# EAGLE design l298_updated (EAGLE 8.0.0)
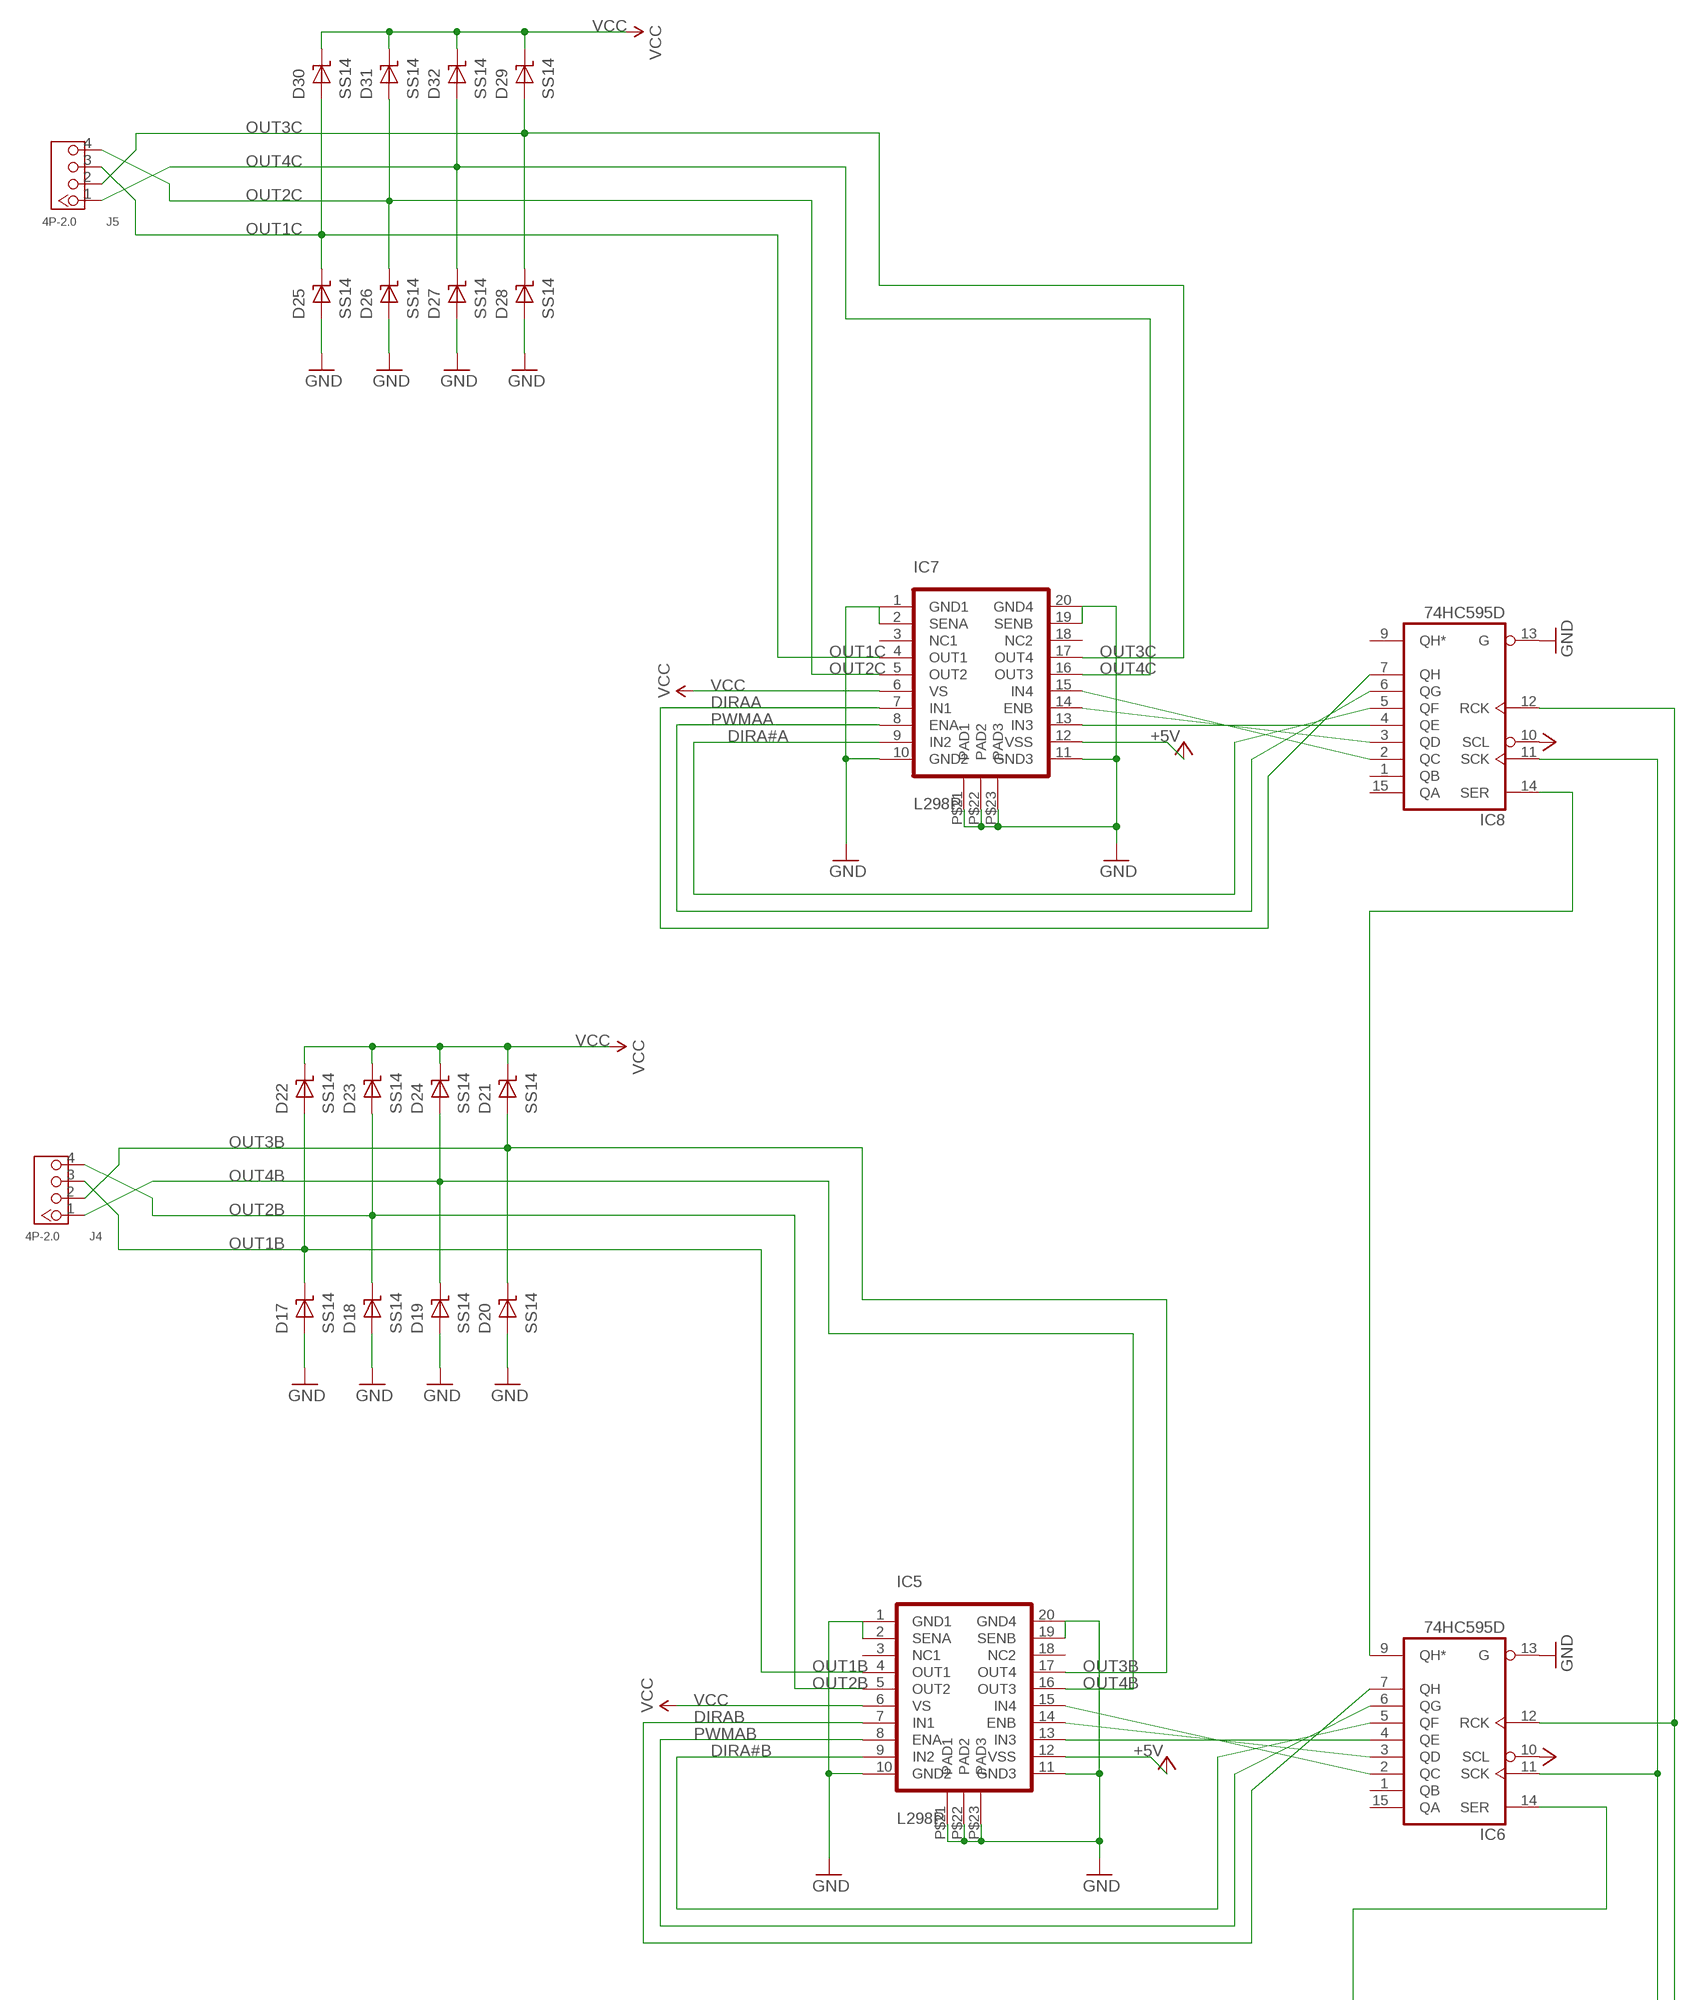
[diagram p0: schematic, sheet 1, part 1 of 2]
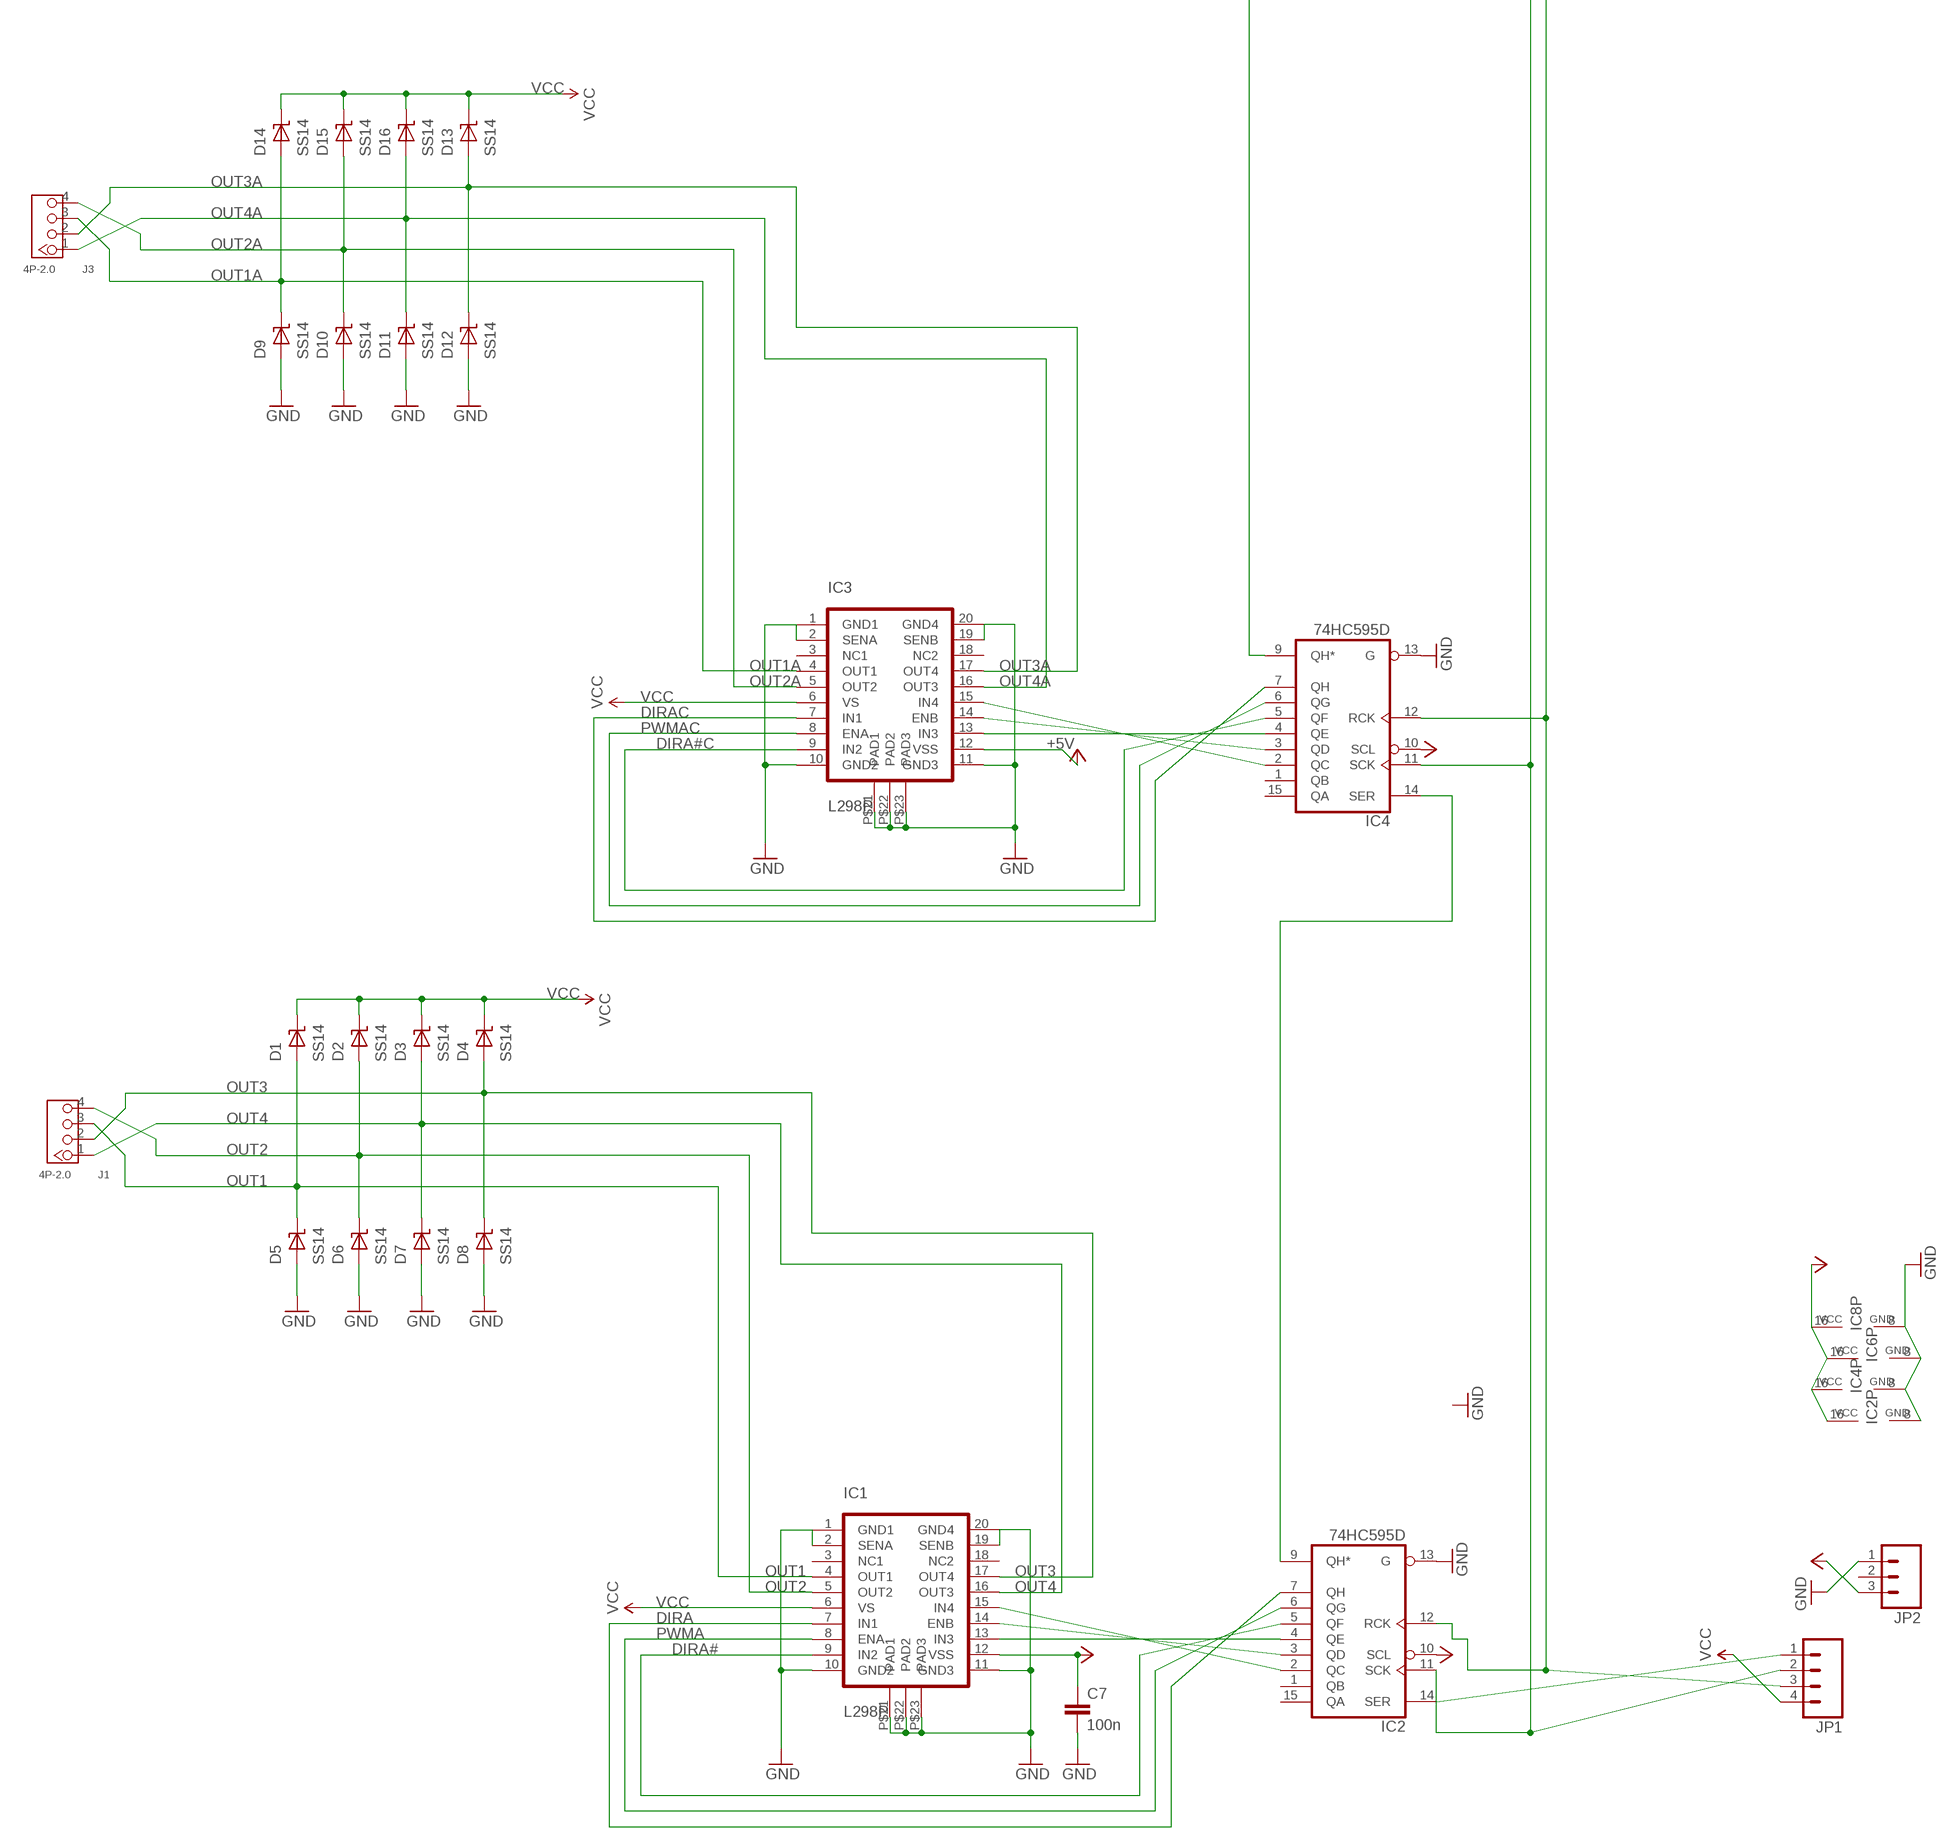
[diagram p1: schematic, sheet 1, part 2 of 2]

## Parts
C7  100n  C-EUC0603  [C0603-ROUND]
D1  SS14  [SMA]
D2  SS14  [SMA]
D3  SS14  [SMA]
D4  SS14  [SMA]
D5  SS14  [SMA]
D6  SS14  [SMA]
D7  SS14  [SMA]
D8  SS14  [SMA]
D9  SS14  [SMA]
D10  SS14  [SMA]
D11  SS14  [SMA]
D12  SS14  [SMA]
D13  SS14  [SMA]
D14  SS14  [SMA]
D15  SS14  [SMA]
D16  SS14  [SMA]
D17  SS14  [SMA]
D18  SS14  [SMA]
D19  SS14  [SMA]
D20  SS14  [SMA]
D21  SS14  [SMA]
D22  SS14  [SMA]
D23  SS14  [SMA]
D24  SS14  [SMA]
D25  SS14  [SMA]
D26  SS14  [SMA]
D27  SS14  [SMA]
D28  SS14  [SMA]
D29  SS14  [SMA]
D30  SS14  [SMA]
D31  SS14  [SMA]
D32  SS14  [SMA]
IC1  L298P  [POWER-SO20]
IC2  74HC595D  [SO16]
IC3  L298P  [POWER-SO20]
IC4  74HC595D  [SO16]
IC5  L298P  [POWER-SO20]
IC6  74HC595D  [SO16]
IC7  L298P  [POWER-SO20]
IC8  74HC595D  [SO16]
J1  4P-2.0  GROVE-CONNECTOR-DIP(4P-2.0)  [HW4-2.0]
J3  4P-2.0  GROVE-CONNECTOR-DIP(4P-2.0)  [HW4-2.0]
J4  4P-2.0  GROVE-CONNECTOR-DIP(4P-2.0)  [HW4-2.0]
J5  4P-2.0  GROVE-CONNECTOR-DIP(4P-2.0)  [HW4-2.0]
JP1  M04PTH  [1X04]
JP2  M03PTH  [1X03]

## Nets
+5V [power]: C7.1 IC1.P$12(VSS) IC2.10(SCL) IC2.16(VCC) IC3.P$12(VSS) IC4.10(SCL) IC4.16(VCC) IC5.P$12(VSS) IC6.10(SCL) IC6.16(VCC) IC7.P$12(VSS) IC8.10(SCL) IC8.16(VCC) JP2.3
DIRA [Data]: IC1.P$7(IN1) IC2.7(QH)
DIRA# [Data]: IC1.P$9(IN2) IC2.5(QF)
DIRA#A [Data]: IC7.P$9(IN2) IC8.5(QF)
DIRA#B [Data]: IC5.P$9(IN2) IC6.5(QF)
DIRA#C [Data]: IC3.P$9(IN2) IC4.5(QF)
DIRAA [Data]: IC7.P$7(IN1) IC8.7(QH)
DIRAB [Data]: IC5.P$7(IN1) IC6.7(QH)
DIRAC [Data]: IC3.P$7(IN1) IC4.7(QH)
GND [Data]: C7.2 D5.P$2(A) D6.P$2(A) D7.P$2(A) D8.P$2(A) D9.P$2(A) D10.P$2(A) D11.P$2(A) D12.P$2(A) D17.P$2(A) D18.P$2(A) D19.P$2(A) D20.P$2(A) D25.P$2(A) D26.P$2(A) D27.P$2(A) D28.P$2(A) IC1.P$1(GND1) IC1.P$2(SENA) IC1.P$10(GND2) IC1.P$11(GND3) IC1.P$19(SENB) IC1.P$20(GND4) IC1.P$21(PAD1) IC1.P$22(PAD2) IC1.P$23(PAD3) IC2.8(GND) IC2.13(G) IC3.P$1(GND1) IC3.P$2(SENA) IC3.P$10(GND2) IC3.P$11(GND3) IC3.P$19(SENB) IC3.P$20(GND4) IC3.P$21(PAD1) IC3.P$22(PAD2) IC3.P$23(PAD3) IC4.8(GND) IC4.13(G) IC5.P$1(GND1) IC5.P$2(SENA) IC5.P$10(GND2) IC5.P$11(GND3) IC5.P$19(SENB) IC5.P$20(GND4) IC5.P$21(PAD1) IC5.P$22(PAD2) IC5.P$23(PAD3) IC6.8(GND) IC6.13(G) IC7.P$1(GND1) IC7.P$2(SENA) IC7.P$10(GND2) IC7.P$11(GND3) IC7.P$19(SENB) IC7.P$20(GND4) IC7.P$21(PAD1) IC7.P$22(PAD2) IC7.P$23(PAD3) IC8.8(GND) IC8.13(G) JP2.1
N$1 [Data]: IC2.9(QH*) IC4.14(SER)
N$2: IC4.9(QH*) IC6.14(SER)
N$3: IC6.9(QH*) IC8.14(SER)
N$4 [Data]: IC1.P$13(IN3) IC2.4(QE)
N$5 [Data]: IC1.P$14(ENB) IC2.3(QD)
N$6 [Data]: IC2.14(SER) JP1.1
N$7 [Data]: IC2.11(SCK) IC4.11(SCK) IC6.11(SCK) IC8.11(SCK) JP1.2
N$8 [Data]: IC2.12(RCK) IC4.12(RCK) IC6.12(RCK) IC8.12(RCK) JP1.3
N$9 [Data]: IC1.P$15(IN4) IC2.2(QC)
N$10 [Data]: IC3.P$13(IN3) IC4.4(QE)
N$11 [Data]: IC3.P$14(ENB) IC4.3(QD)
N$12 [Data]: IC3.P$15(IN4) IC4.2(QC)
N$13 [Data]: IC5.P$13(IN3) IC6.4(QE)
N$14 [Data]: IC5.P$14(ENB) IC6.3(QD)
N$15 [Data]: IC5.P$15(IN4) IC6.2(QC)
N$16 [Data]: IC7.P$13(IN3) IC8.4(QE)
N$17 [Data]: IC7.P$14(ENB) IC8.3(QD)
N$18 [Data]: IC7.P$15(IN4) IC8.2(QC)
OUT1 [power]: D1.P$2(A) D5.P$1(K) IC1.P$4(OUT1) J1.3
OUT1A [power]: D9.P$1(K) D14.P$2(A) IC3.P$4(OUT1) J3.3
OUT1B [power]: D17.P$1(K) D22.P$2(A) IC5.P$4(OUT1) J4.3
OUT1C [power]: D25.P$1(K) D30.P$2(A) IC7.P$4(OUT1) J5.3
OUT2 [power]: D2.P$2(A) D6.P$1(K) IC1.P$5(OUT2) J1.4
OUT2A [power]: D10.P$1(K) D15.P$2(A) IC3.P$5(OUT2) J3.4
OUT2B [power]: D18.P$1(K) D23.P$2(A) IC5.P$5(OUT2) J4.4
OUT2C [power]: D26.P$1(K) D31.P$2(A) IC7.P$5(OUT2) J5.4
OUT3 [power]: D4.P$2(A) D8.P$1(K) IC1.P$17(OUT4) J1.2
OUT3A [power]: D12.P$1(K) D13.P$2(A) IC3.P$17(OUT4) J3.2
OUT3B [power]: D20.P$1(K) D21.P$2(A) IC5.P$17(OUT4) J4.2
OUT3C [power]: D28.P$1(K) D29.P$2(A) IC7.P$17(OUT4) J5.2
OUT4 [power]: D3.P$2(A) D7.P$1(K) IC1.P$16(OUT3) J1.1
OUT4A [power]: D11.P$1(K) D16.P$2(A) IC3.P$16(OUT3) J3.1
OUT4B [power]: D19.P$1(K) D24.P$2(A) IC5.P$16(OUT3) J4.1
OUT4C [power]: D27.P$1(K) D32.P$2(A) IC7.P$16(OUT3) J5.1
PWMA [Data]: IC1.P$8(ENA) IC2.6(QG)
PWMAA [Data]: IC7.P$8(ENA) IC8.6(QG)
PWMAB [Data]: IC5.P$8(ENA) IC6.6(QG)
PWMAC [Data]: IC3.P$8(ENA) IC4.6(QG)
VCC [Data]: D1.P$1(K) D2.P$1(K) D3.P$1(K) D4.P$1(K) D13.P$1(K) D14.P$1(K) D15.P$1(K) D16.P$1(K) D21.P$1(K) D22.P$1(K) D23.P$1(K) D24.P$1(K) D29.P$1(K) D30.P$1(K) D31.P$1(K) D32.P$1(K) IC1.P$6(VS) IC3.P$6(VS) IC5.P$6(VS) IC7.P$6(VS) JP1.4
Unconnected: IC1.P$3(NC1) IC1.P$18(NC2) IC2.1(QB) IC2.15(QA) IC3.P$3(NC1) IC3.P$18(NC2) IC4.1(QB) IC4.15(QA) IC5.P$3(NC1) IC5.P$18(NC2) IC6.1(QB) IC6.15(QA) IC7.P$3(NC1) IC7.P$18(NC2) IC8.1(QB) IC8.9(QH*) IC8.15(QA) JP2.2

## Library data of the parts
C7 = SmartPrj:C-EU: CAPACITOR, European symbol
D1-D32 = SmartPrj:SS14: DIODE SS14 Diode Schottky 1A 40v
IC1 IC3 IC5 IC7 = SmartPrj:L298P: L298P DUAL FUL-BRIDGE DRIVER PowerSO20
IC2 IC4 IC6 IC8 = 74xx:74*595: 8-bit SHIFT REGISTER, output latch
J1 J3-J5 = Seeed-OPL-Connector:GROVE-CONNECTOR-DIP(4P-2.0): 320110033
JP1 = SparkFun:M04: Header 4 Standard 4-pin 0.1" header. Use with straight break away headers (SKU : PRT-00116), right angle break away headers (PRT-00553), swiss pins (PRT-00743), machine pins (PRT-00117), and female headers (PRT-00115). Molex polarized connector foot print use with SKU : PRT-08231 with associated crimp pins and housings.
JP2 = SparkFun:M03: Header 3 Standard 3-pin 0.1" header. Use with straight break away headers (SKU : PRT-00116), right angle break away headers (PRT-00553), swiss pins (PRT-00743), machine pins (PRT-00117), and female headers (PRT-00115). Molex polarized connector foot print use with SKU : PRT-08232 with associated crimp pins and housings.

## Net classes
0 default: width 0.305 mm, drill 0.991 mm, clearance 0.102 mm
1 power: width 0.305 mm, drill 0.991 mm, clearance 0.102 mm
2 VIN: width 0.305 mm, drill 0.991 mm, clearance 0.102 mm
3 Data: width 0.203 mm, drill 0.991 mm, clearance 0.102 mm

## Board
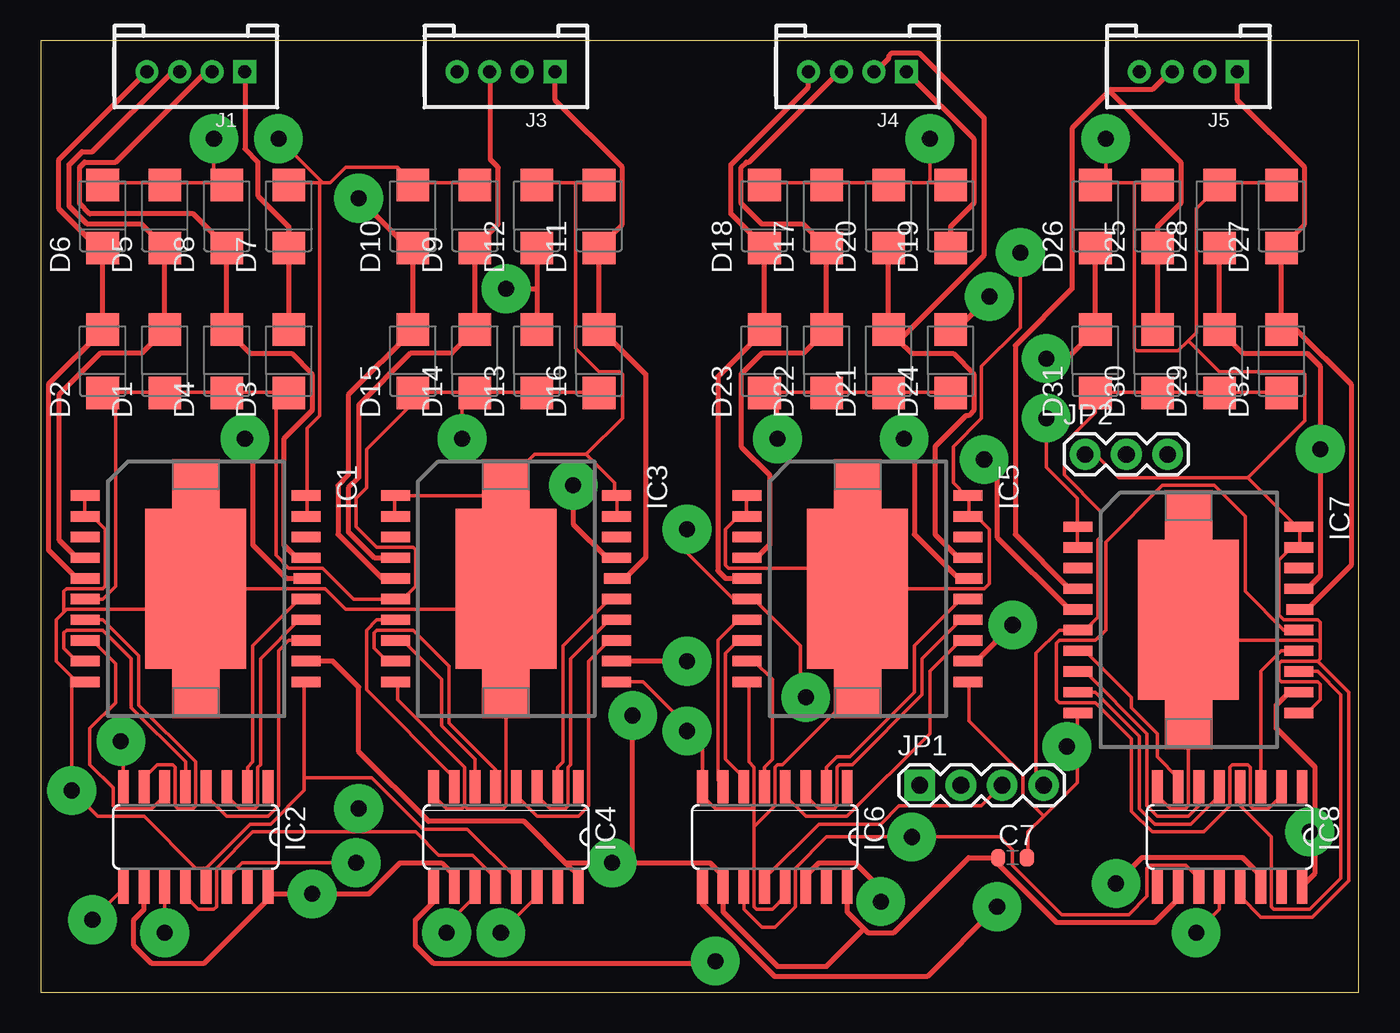
[diagram p2: board, top side]
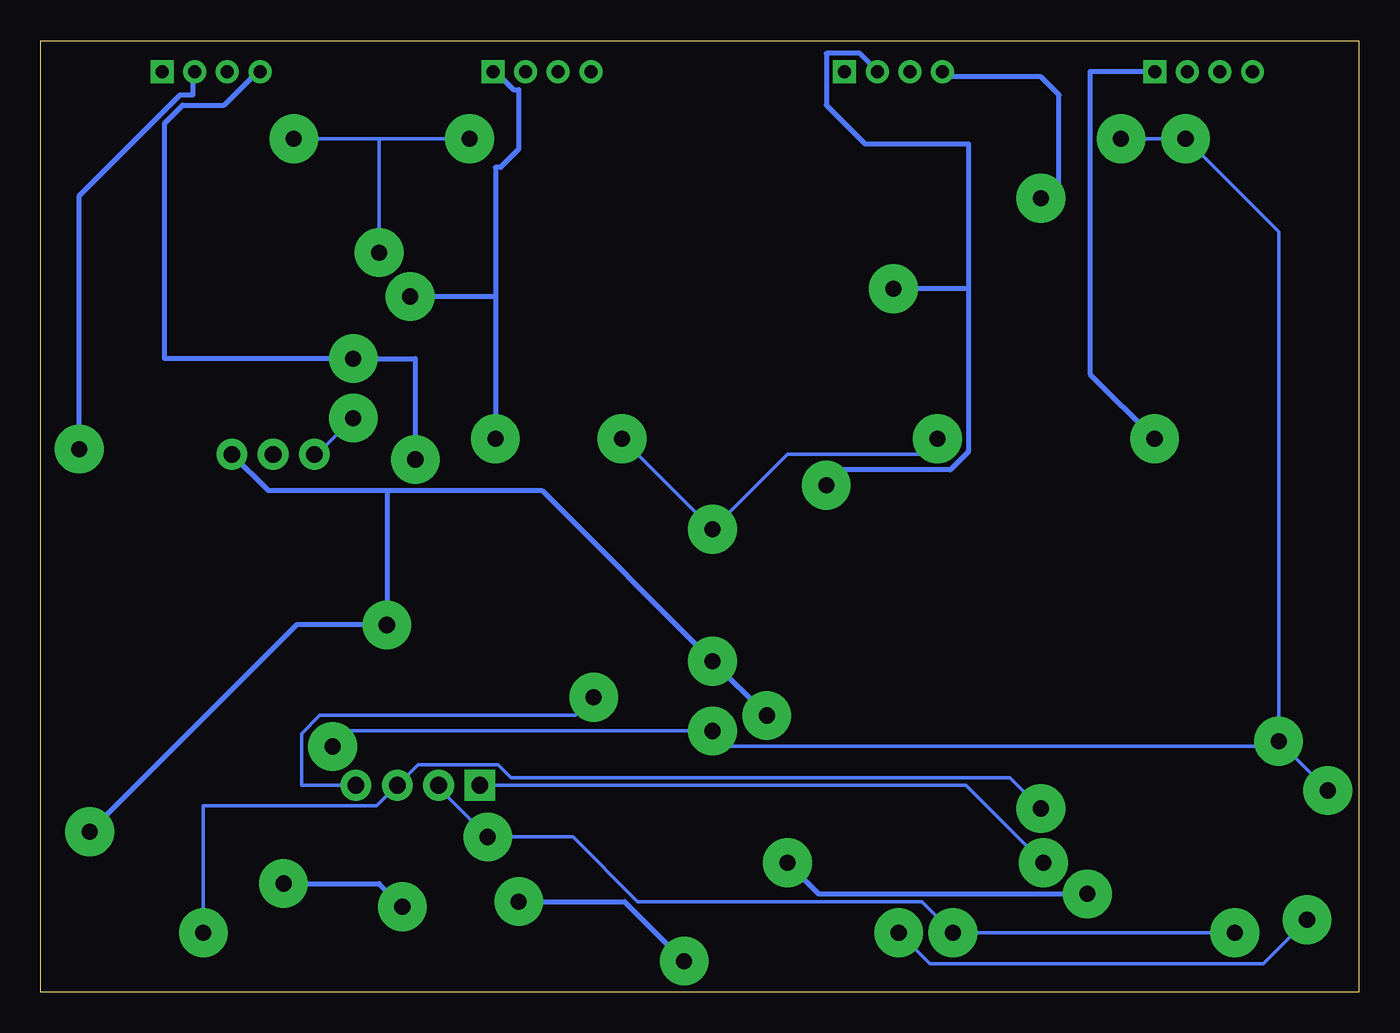
[diagram p3: board, bottom side, seen from below]

Size 80.95 x 58.41 mm. Coordinates in mm from the lower left corner, seen from the top.
Outline: 0,0 80.95,0 80.95,58.41 0,58.41 0,0
Copper layers (1*16): Top 0.035mm / dielectric 1.5mm / Bottom 0.035mm
Design rules "SparkFun *": minimum track width 8mil, minimum drill 20mil, track to track 8mil, track to pad 8mil, pad to pad 8mil, via to via 8mil, smd to smd 8mil, copper to edge 10mil, drill to drill 8mil, minimum pad ring 12mil, minimum via ring 1mm, stop-mask expansion 4mil, vias tented up to drill 25mil, thermal gap 10mil

### Footprints (pad centres in the part's own frame; a part is rotated, then mirrored left to right if it is on the bottom)
C0603-ROUND = smd 0.898 x 1.1: 1 -0.889,0; 2 0.889,0
SMA = smd 2 x 2: P$1 -1.94,0; P$2 1.94,0
POWER-SO20 = smd 0.635 x 1.778: P$1 -5.715,-6.782; P$2 -4.445,-6.782; P$3 -3.175,-6.782; P$4 -1.905,-6.782; P$5 -0.635,-6.782; P$6 0.635,-6.782; P$7 1.905,-6.782; P$8 3.175,-6.782; P$9 4.445,-6.782; P$10 5.715,-6.782; P$11 5.715,6.782; P$12 4.445,6.782; P$13 3.175,6.782; P$14 1.905,6.782; P$15 0.635,6.782; P$17 -1.905,6.782; P$18 -3.175,6.782; P$19 -4.445,6.782; P$20 -5.715,6.782 | smd 0.635 x 1.651: P$16 -0.635,6.833 | smd 9.804 x 6.198: P$21 0,0 | smd 3.048 x 2.921: P$22 -6.426,0; P$23 6.426,0
SO16 = smd 0.66 x 2.032: 1 -4.445,-3.073; 2 -3.175,-3.073; 3 -1.905,-3.073; 4 -0.635,-3.073; 5 0.635,-3.073; 6 1.905,-3.073; 7 3.175,-3.073; 8 4.445,-3.073; 9 4.445,3.073; 10 3.175,3.073; 11 1.905,3.073; 12 0.635,3.073; 13 -0.635,3.073; 14 -1.905,3.073; 15 -3.175,3.073; 16 -4.445,3.073
HW4-2.0 = drill 0.8 pad 1.27 square: 1 -3,0 | drill 0.8 pad 1.27: 2 -1,0; 3 1,0; 4 3,0
1X04 = drill 1.016 pad 1.88 square: 1 0,0 | drill 1.016 pad 1.88: 2 2.54,0; 3 5.08,0; 4 7.62,0
1X03 = drill 1.016 pad 1.88: 1 0,0; 2 2.54,0; 3 5.08,0

### Placement (x,y rotation side)
C7  59.69,8.26 0 top
D1  7.62,38.73 90 top
D2  3.81,38.73 90 top
D3  15.24,38.73 90 top
D4  11.43,38.73 90 top
D5  7.62,47.62 90 top
D6  3.81,47.62 90 top
D7  15.24,47.62 90 top
D8  11.43,47.62 90 top
D9  26.67,47.62 90 top
D10  22.86,47.62 90 top
D11  34.29,47.62 90 top
D12  30.48,47.62 90 top
D13  30.48,38.73 90 top
D14  26.67,38.73 90 top
D15  22.86,38.73 90 top
D16  34.29,38.73 90 top
D17  48.26,47.62 90 top
D18  44.45,47.62 90 top
D19  55.88,47.62 90 top
D20  52.07,47.62 90 top
D21  52.07,38.73 90 top
D22  48.26,38.73 90 top
D23  44.45,38.73 90 top
D24  55.88,38.73 90 top
D25  68.58,47.62 90 top
D26  64.77,47.62 90 top
D27  76.2,47.62 90 top
D28  72.39,47.62 90 top
D29  72.39,38.73 90 top
D30  68.58,38.73 90 top
D31  64.77,38.73 90 top
D32  76.2,38.73 90 top
IC1  9.53,24.77 270 top
IC2  9.53,9.53 180 top
IC3  28.57,24.77 270 top
IC4  28.57,9.53 180 top
IC5  50.16,24.77 270 top
IC6  45.09,9.53 180 top
IC7  70.48,22.86 270 top
IC8  73.03,9.53 180 top
J1  9.53,56.52 180 top
J3  28.57,56.52 180 top
J4  50.16,56.52 180 top
J5  70.48,56.52 180 top
JP1  53.98,12.7 0 top
JP2  64.14,33.02 0 top

### Tracks (layer width: path | path; a pad name or v marks a point on that pad's centre or on a via)
+5V  (via drill 0.99)
  Top 0.305: IC7.P$12 76.68,18.41 75.88,17.62 75.88,16.19 78.26,13.81 78.26,9.84 | 78.26,9.84 78.26,7.3 77.47,6.51 IC8.16 | v39.69,20.32 IC3.P$12 | IC5.P$12 57.47,20.32 v59.69,22.54 | v77.95,9.84 78.26,9.84 | 58.42,8.26 56.99,8.26 52.39,3.65 50.8,3.65 50.56,3.89 | 58.42,8.26 C7.1 58.74,8.26 | 50.56,3.89 49.53,4.92 IC6.16 | IC8.10 69.85,5.71 68.42,4.29 62.39,4.29 58.42,8.26 | IC2.10 6.35,5.08 5.71,4.45 5.71,2.86 6.83,1.75 10,1.75 13.97,5.71 13.97,6.03 | 13.97,6.03 IC2.16 13.97,6.35 | IC4.10 25.4,7.14 24.61,7.94 22.07,7.94 20.16,6.03 v16.67,6.03 13.97,6.03 | IC1.P$12 17.94,20.32 19.53,18.73 19.53,14.76 23.81,10.48 29.69,10.48 32.31,7.86 | 32.31,7.86 33.02,7.14 IC4.16 | 36.35,7.94 41.12,7.94 41.91,7.14 IC6.10 41.91,4.92 45.24,1.59 48.26,1.59 50.56,3.89 | 32.31,7.86 32.38,7.94 v35.08,7.94 36.35,7.94 | 36.35,7.94 v36.35,16.99
  Bottom 0.305: 59.69,30.8 66.99,30.8 JP2.3 | 59.69,30.8 50.16,30.8 v39.69,20.32 v36.35,16.99 | 59.69,30.8 v59.69,22.54 65.25,22.54 v77.95,9.84 | v16.67,6.03 33.18,6.03 v35.08,7.94
DIRA
  Top 0.203: IC1.P$7 3.81,22.86 6.03,20.64 6.03,17.62 9.53,14.13 9.53,11.43 9.37,11.27 8.41,11.27 8.26,11.43 8.26,13.81 8.1,13.97 7.14,13.97 6.35,13.18 IC2.7
DIRA#
  Top 0.203: IC1.P$9 2.22,20.32 1.43,21.11 1.43,22.07 1.59,22.23 3.81,22.23 5.56,20.48 5.56,17.46 8.89,14.13 IC2.5
DIRA#A
  Top 0.203: IC7.P$9 64.77,18.41 67.47,15.72 67.47,11.27 68.42,10.32 70.64,10.32 72.39,12.06 IC8.5
DIRA#B
  Top 0.203: IC5.P$9 43.81,20.32 44.93,19.21 44.93,14.29 44.45,13.81 IC6.5
DIRA#C
  Top 0.203: IC3.P$9 21.27,20.32 20.48,21.11 20.48,22.07 20.64,22.23 22.86,22.23 25.08,20 25.08,16.51 27.94,13.65 IC4.5
DIRAA
  Top 0.203: IC7.P$7 64.14,20.95 66.99,18.1 66.99,17.46 68.58,15.88 68.58,14.45 69.85,13.18 IC8.7
DIRAB
  Top 0.203: IC5.P$7 42.86,22.86 41.59,21.59 41.59,13.02 41.91,12.7 IC6.7
DIRAC
  Top 0.203: IC3.P$7 20.64,22.86 20,22.23 20,18.57 25.4,13.18 IC4.7
GND  (via drill 0.99)
  Top 0.203: 48.26,49.69 44.45,49.69 D18.P$2 | 48.26,49.69 52.07,49.69 | 48.26,49.69 D17.P$2 | 52.07,49.69 54.61,49.69 | 54.61,49.69 55.88,49.69 D19.P$2 | 52.07,49.69 D20.P$2 | 67.15,49.69 68.58,49.69 D25.P$2 | 67.15,49.69 65.41,49.69 | 65.41,49.69 64.77,49.69 D26.P$2 65.41,49.69 | D27.P$2 76.2,49.69 72.39,49.69 D28.P$2 72.39,49.53 70.96,48.1 70.96,40.48 70.48,40.01 | 67.15,49.69 67.15,39.53 67.31,39.37 69.85,39.37 70.48,40.01 | v54.61,52.39 54.61,49.69 | 65.41,49.69 v65.41,52.39 | 63.66,28.57 63.66,27.3 IC7.P$2 | 63.66,28.57 63.66,30.32 61.75,32.23 v61.75,35.24 | 63.66,28.57 IC7.P$1 | IC8.8 68.58,12.06 69.37,11.27 70.33,11.27 70.48,11.43 IC7.P$23 IC7.P$21 | IC7.P$11 77.79,17.14 78.58,17.94 78.58,18.89 78.42,19.05 76.2,19.05 76.04,19.21 76.04,20.16 76.2,20.32 78.42,20.32 | 78.42,20.32 78.58,20.48 78.58,21.43 | 78.58,21.43 78.42,21.59 71.75,21.59 IC7.P$21 | IC8.13 73.66,5.87 74.93,4.6 78.11,4.6 80.33,6.83 80.33,18.41 78.42,20.32 | 78.58,21.43 78.58,22.7 78.42,22.86 76.36,22.86 76.04,23.18 76.04,26.51 76.83,27.3 IC7.P$19 77.31,27.3 77.31,28.57 IC7.P$20 77.15,28.57 74.14,31.59 | IC7.P$21 IC7.P$22 | JP2.1 64.77,33.02 66.2,31.59 74.14,31.59 | 70.48,40.01 72.39,38.1 77.47,38.1 77.63,37.94 77.63,35.08 74.14,31.59 | 56.99,29.21 56.99,30.48 IC5.P$20 56.83,30.48 56.04,31.27 56.04,33.5 57.78,35.24 57.78,38.42 60.17,40.8 v60.17,45.4 | 43.34,29.21 43.34,30.48 IC5.P$1 | 43.34,29.21 42.86,29.21 42.07,28.42 42.07,26.19 42.23,26.04 48.9,26.04 IC5.P$21 | 43.34,29.21 IC5.P$2 | 56.99,29.21 57.47,29.21 58.26,28.42 58.26,25.08 57.94,24.77 IC5.P$21 | 56.99,29.21 IC5.P$19 | IC5.P$21 IC5.P$23 50.16,18.26 49.85,18.26 45.56,13.97 45.24,13.97 45.09,13.81 45.09,11.43 43.81,10.16
  Top 0.203: IC5.P$21 IC5.P$22 | 61.59,10.79 63.66,12.86 63.66,15.08 | 61.59,10.79 60.64,9.84 60.64,8.26 C7.2 | 63.66,15.08 63.66,17.14 IC7.P$10 | 61.59,10.79 60.33,12.06 60.33,13.34 56.99,16.67 56.99,19.05 IC5.P$11 | IC3.P$11 36.99,19.05 39.85,16.19 | 39.85,16.19 40.64,15.4 IC6.8 40.64,12.06 41.43,11.27 43.66,11.27 43.81,11.43 | 43.81,11.43 43.81,13.81 43.5,14.13 43.5,19.05 IC5.P$10 | IC6.13 45.72,5.87 44.93,5.08 43.97,5.08 43.81,5.24 43.81,10.16 | 43.81,11.43 43.81,10.16 | v63.02,15.08 63.66,15.08 | 39.85,16.19 v39.69,16.03 | 26.04,11.43 26.04,13.81 21.91,17.94 21.91,19.05 IC3.P$10 | 26.04,11.43 25.88,11.27 24.92,11.27 24.13,12.06 IC4.8 | 28.57,23.5 IC3.P$23 28.57,11.43 28.42,11.27 26.19,11.27 26.04,11.43 | 32.86,49.69 34.29,49.69 D11.P$2 | 32.86,49.69 30.48,49.69 D12.P$2 | IC3.P$19 35.4,29.21 35.4,30.48 IC3.P$20 35.24,30.48 35.24,31.27 33.5,33.02 | IC3.P$2 21.75,29.21 21.75,30.48 IC3.P$1 27.94,30.48 28.57,31.11 | 33.5,33.02 30.32,33.02 28.57,31.27 IC3.P$22 28.57,31.11 | 32.86,49.69 32.86,39.53 34.29,38.1 35.56,38.1 35.72,37.94 35.72,35.24 33.5,33.02 | 28.57,31.11 IC3.P$21 28.57,23.5 | 7.62,49.69 3.81,49.69 D6.P$2 | 7.62,49.69 10.64,49.69 | 10.64,49.69 11.43,49.69 D8.P$2 10.64,49.69 | 7.62,49.69 D5.P$2 | 16.35,30.48 16.35,29.21 IC1.P$19 | 17.3,49.69 17.78,49.69 18.73,50.64 21.91,50.64 22.86,49.69 | 17.3,49.69 17.14,49.69 | 17.14,49.69 15.24,49.69 D7.P$2 | 22.86,49.69 26.67,49.69 D9.P$2 | 22.86,49.69 D10.P$2 | 16.35,30.48 16.35,34.61 17.14,35.4 17.14,49.69 | 16.35,30.48 IC1.P$20 | v10.64,52.39 10.64,49.69 | 17.3,49.69 v14.61,52.39 | 16.19,13.18 16.19,12.38 14.13,10.32 12.86,10.32 10.16,7.62 | 16.19,13.18 16.19,19.05 IC1.P$11
  Top 0.203: IC2.13 10.16,7.62 | IC4.13 29.21,6.99 26.19,10 23.5,10 20.32,13.18 16.19,13.18 | IC1.P$1 2.7,30.48 2.7,29.21 IC1.P$2 3.17,29.21 3.97,28.42 3.97,24.92 3.81,24.77 1.59,24.77 1.43,24.61 1.43,23.34 | IC1.P$10 2.22,19.05 1.91,19.37 | 1.91,19.37 0.95,20.32 0.95,22.86 1.43,23.34 | 1.43,23.34 1.59,23.5 8.26,23.5 IC1.P$21 | IC2.8 5.08,15.24 v4.92,15.4 | 1.91,19.37 v1.91,12.38 3.49,10.79 6.35,10.79 9.53,7.62 10.16,7.62 | IC1.P$21 IC1.P$23 | IC1.P$21 IC1.P$22 | 28.57,23.5 18.73,23.5 17.46,24.77 IC1.P$21
  Bottom 0.203: v65.41,52.39 60.17,52.39 | 60.17,52.39 v54.61,52.39 | v61.75,35.24 63.98,33.02 JP2.1 | v63.02,15.08 62.07,16.03 v39.69,16.03 38.73,15.08 4.6,15.08 | v14.61,52.39 v10.64,52.39 4.92,46.67 v4.92,15.4 4.6,15.08 | v1.91,12.38 4.6,15.08 | v60.17,45.4 60.17,52.39
N$1  (via drill 0.99)
  Top 0.203: v3.17,4.45 5.08,6.35 IC2.9 | v28.26,3.65 30.48,5.87 IC4.14
  Bottom 0.203: v3.17,4.45 5.87,1.75 26.35,1.75 v28.26,3.65
N$2  (via drill 0.99)
  Top 0.305: IC4.9 24.13,5.56 23.02,4.45 23.02,2.86 24.13,1.75 41.27,1.75 v41.43,1.91 | v51.59,5.56 51.59,6.35 50.01,7.94 47.78,7.94 46.99,7.14 IC6.14
  Bottom 0.305: v41.43,1.91 45.09,5.56 v51.59,5.56
N$3  (via drill 0.99)
  Top 0.305: IC6.9 40.64,5.4 45.09,0.95 54.45,0.95 v58.74,5.24 | v66.04,6.67 67.63,8.26 73.82,8.26 74.93,7.14 IC8.14
  Bottom 0.305: v58.74,5.24 60.17,6.67 v66.04,6.67
N$4
  Top 0.203: IC1.P$13 15.24,21.59 14.61,20.95 14.61,11.43 13.97,10.79 11.43,10.79 10.16,12.06 IC2.4
N$5
  Top 0.203: IC1.P$14 15.88,22.86 13.49,20.48 13.49,13.97 13.34,13.81 13.34,11.43 13.18,11.27 12.22,11.27 11.43,12.06 IC2.3
N$6  (via drill 0.99)
  Top 0.203: IC2.14 11.43,6.99 12.38,7.94 v19.37,7.94
  Bottom 0.203: v19.37,7.94 24.13,12.7 JP1.1
N$7  (via drill 0.99)
  Top 0.203: v7.62,3.65 IC2.11 | v24.92,3.65 24.92,4.13 26.67,5.87 IC4.11 | IC6.11 43.18,5.08 44.29,3.97 45.09,3.97 46.35,5.24 46.35,7.62 48.26,9.53 v53.5,9.53 58.9,9.53 59.69,8.73 59.69,7.78 62.71,4.76 66.83,4.76 67.94,5.87 67.94,7.62 68.1,7.78 70.33,7.78 71.12,6.99 IC8.11
  Bottom 0.203: v7.62,3.65 v24.92,3.65 26.83,5.56 44.29,5.56 48.26,9.53 v53.5,9.53 56.52,12.54 JP1.2
N$8  (via drill 0.99)
  Top 0.203: IC2.12 8.89,5.87 9.68,5.08 10.64,5.08 10.79,5.24 10.79,7.62 13.02,9.84 19.53,9.84 | 19.53,9.84 23.02,9.84 24.45,8.41 26.51,8.41 27.94,6.99 IC4.12 | IC6.12 44.45,6.99 47.78,10.32 51.59,10.32 52.7,11.43 57.78,11.43 JP1.3 | IC8.12 72.39,5.08 v70.96,3.65 | v19.53,11.27 19.53,9.84
  Bottom 0.203: v70.96,3.65 70.96,11.43 60.33,11.43 JP1.3 57.78,13.97 52.86,13.97 52.07,13.18 21.43,13.18 v19.53,11.27
N$9
  Top 0.203: IC1.P$15 15.88,24.13 13.02,21.27 13.02,14.13 12.7,13.81 IC2.2
N$10
  Top 0.203: IC3.P$13 34.92,21.59 33.66,20.32 33.66,11.43 33.02,10.79 30.48,10.79 29.21,12.06 IC4.4
N$11
  Top 0.203: IC3.P$14 34.92,22.86 32.54,20.48 32.54,13.97 32.38,13.81 32.38,11.43 32.23,11.27 31.27,11.27 30.48,12.06 IC4.3
N$12
  Top 0.203: IC3.P$15 34.92,24.13 32.07,21.27 32.07,14.13 31.75,13.81 IC4.2
N$13
  Top 0.203: IC5.P$13 56.52,21.59 54.61,19.68 54.61,15.88 49.53,10.79 46.99,10.79 45.72,12.06 IC6.4
N$14
  Top 0.203: IC5.P$14 56.52,22.86 54.13,20.48 54.13,18.26 49.85,13.97 49.05,13.97 48.9,13.81 48.9,11.43 48.74,11.27 47.78,11.27 46.99,12.06 IC6.3
N$15
  Top 0.203: IC5.P$15 56.52,24.13 53.66,21.27 53.66,18.41 49.69,14.45 48.9,14.45 48.26,13.81 IC6.2
N$16
  Top 0.203: IC7.P$13 78.42,19.68 79.85,18.26 79.85,6.99 77.95,5.08 75.72,5.08 75.56,5.24 75.56,9.53 73.66,11.43 IC8.4
N$17
  Top 0.203: IC7.P$14 76.2,20.95 74.93,19.68 IC8.3
N$18
  Top 0.203: IC7.P$15 76.36,22.23 73.98,24.61 73.98,29.21 72.07,31.11 68.9,31.11 65.41,27.62 65.41,22.23 64.77,21.59 62.55,21.59 62.39,21.43 62.39,17.94 62.55,17.78 64.77,17.78 66.99,15.56 66.99,11.11 68.26,9.84 71.44,9.84 73.03,11.43 73.03,13.81 73.18,13.97 74.14,13.97 74.3,13.81 74.3,11.43 74.45,11.27 75.41,11.27 76.2,12.06 IC8.2
OUT1
  Top 0.305: IC1.P$4 2.22,26.67 1.11,27.78 1.11,36.67 3.65,39.21 6.19,39.21 7.62,40.64 D1.P$2 D5.P$1 7.62,45.72 6.19,47.15 2.86,47.15 1.75,48.26 1.75,50.8 2.54,51.59 3.17,51.59 8.1,56.52 J1.3
OUT1A
  Top 0.305: IC3.P$4 20.48,26.67 18.89,28.26 18.89,30.96 19.53,31.59 19.53,36.04 22.7,39.21 25.24,39.21 26.67,40.64 D14.P$2 D9.P$1 26.67,45.72 28.1,47.15 28.1,50.64 27.62,51.12 27.62,56.52 J3.3
OUT1B
  Top 0.305: IC5.P$4 43.97,26.67 44.77,27.46 44.77,31.75 43.02,33.5 43.02,37.94 44.29,39.21 46.83,39.21 48.26,40.64 D22.P$2 D17.P$1 48.26,45.72 46.83,47.15 44.29,47.15 43.02,48.42 43.02,50.64 43.34,50.96 43.5,50.96 49.05,56.52 J4.3
OUT1C
  Top 0.305: D30.P$2 D25.P$1 68.58,46.99 70.01,48.42 70.01,50.96 65.64,55.32 | IC7.P$4 63.18,24.77 59.85,28.1 59.85,39.69 63.34,43.18 63.34,53.02 65.64,55.32 | 65.64,55.32 65.72,55.4 68.26,55.4 69.37,56.52 J5.3
OUT2
  Top 0.305: IC1.P$5 2.22,25.4 0.48,27.15 0.48,37.31 3.81,40.64 D2.P$2 3.81,45.4 | 3.81,45.4 D6.P$1 3.81,45.56 | 3.81,45.4 1.11,48.1 1.11,51.12 6.51,56.52 J1.4
OUT2A  (via drill 0.99)
  Top 0.305: IC3.P$5 20.95,25.4 18.26,28.1 18.26,31.11 18.89,31.75 18.89,36.67 22.86,40.64 D15.P$2 22.86,45.4 | 22.86,45.4 D10.P$1 22.86,45.56 | 22.86,45.4 v19.53,48.74
  Bottom 0.305: v19.53,48.74 18.41,48.74 18.41,55.09 19.53,56.2 25.24,56.2 J3.4
OUT2B
  Top 0.305: IC5.P$5 42.07,25.4 41.59,25.88 41.59,37.78 44.45,40.64 D23.P$2 D18.P$1 44.45,45.72 42.39,47.78 42.39,50.8 47.15,55.56 J4.4
OUT2C  (via drill 0.99)
  Top 0.305: IC7.P$5 63.18,23.5 58.74,27.94 58.74,31.91 v57.94,32.7 | v61.75,38.89 63.02,38.89 64.77,40.64 D31.P$2 D26.P$1
  Bottom 0.305: v57.94,32.7 57.94,38.89 v61.75,38.89 73.34,38.89 73.34,53.34 72.23,54.45 69.69,54.45 67.63,56.52 J5.4
OUT3
  Top 0.305: IC1.P$17 15.72,26.67 14.92,27.46 14.92,33.97 16.67,35.72 16.67,37.94 15.4,39.21 12.86,39.21 11.43,40.64 D4.P$2 D8.P$1 11.43,45.72 9.37,47.78 3.02,47.78 2.38,48.42 2.38,50.64 2.7,50.96 4.6,50.96 10.16,56.52 J1.2
OUT3A  (via drill 0.99)
  Top 0.305: D12.P$1 30.48,43.18 | 30.48,43.18 D13.P$2 | IC3.P$17 34.77,26.67 32.7,28.73 v32.7,31.11 | v28.57,43.18 30.48,43.18
  Bottom 0.305: v32.7,31.11 31.75,32.07 25.08,32.07 23.97,33.18 23.97,43.18 | 23.97,43.18 23.97,52.07 30.32,52.07 32.7,54.45 32.7,57.63 30.64,57.63 29.53,56.52 J3.2 | 23.97,43.18 v28.57,43.18
OUT3B
  Top 0.305: IC5.P$17 56.36,26.67 54.93,28.1 54.93,33.5 56.83,35.4 56.99,35.4 57.31,35.72 57.31,37.94 56.04,39.21 53.5,39.21 52.7,40.01 | 52.7,40.01 52.07,40.64 D21.P$2 | D21.P$2 D20.P$1 | 52.7,40.01 57.94,45.24 57.94,53.66 53.98,57.63 52.23,57.63 52.07,57.47 52.07,57.31 51.28,56.52 J4.2 | 52.7,40.01 D21.P$2
OUT3C  (via drill 0.99)
  Top 0.305: IC7.P$17 77.79,24.77 78.58,25.56 v78.58,33.34 78.58,38.42 77.79,39.21 73.82,39.21 72.39,40.64 D29.P$2 D28.P$1
  Bottom 0.305: v78.58,33.34 78.58,48.9 72.39,55.09 71.6,55.09 71.6,56.52 J5.2
OUT4  (via drill 0.99)
  Top 0.305: D3.P$2 D7.P$1 15.24,46.99 13.34,48.9 13.34,50.96 12.54,51.75 12.54,56.52 J1.1 | IC1.P$16 15.08,25.4 13.02,27.46 13.02,33.5 v12.54,33.97
  Bottom 0.305: v12.54,33.97 16.51,37.94 16.51,56.52 J1.1
OUT4A
  Top 0.305: IC3.P$16 35.88,25.4 37.15,26.67 37.15,37.94 34.29,40.8 | 34.29,40.8 D11.P$1 34.29,45.72 35.72,47.15 35.72,50.64 31.59,54.77 31.59,56.52 J3.1 | 34.29,40.8 D16.P$2
OUT4B  (via drill 0.99)
  Top 0.305: IC5.P$16 56.36,25.4 53.66,28.1 53.66,33.34 v53.02,33.97 | v58.26,42.7 56.36,40.8 55.88,40.8 D24.P$2 | D19.P$1 55.88,46.99 57.31,48.42 57.31,52.39 53.18,56.52 J4.1
  Bottom 0.305: 53.02,42.7 53.02,50.64 52.7,50.64 51.59,51.75 51.59,55.4 51.91,55.4 53.02,56.52 J4.1 | 53.02,42.7 v53.02,33.97 | 53.02,42.7 v58.26,42.7
OUT4C
  Top 0.305: IC7.P$16 77.79,23.5 80.49,26.19 80.49,37.31 77.15,40.64 76.2,40.64 D32.P$2 D27.P$1 76.2,45.72 77.63,47.15 77.63,50.64 73.5,54.77 73.5,56.52 J5.1
PWMA
  Top 0.203: IC1.P$8 3.17,21.59 4.6,20.16 4.6,17.78 3.02,16.19 3.02,13.97 4.45,12.54 4.45,11.43 4.6,11.27 6.83,11.27 7.62,12.06 IC2.6
PWMAA
  Top 0.203: IC7.P$8 64.14,19.68 67.94,15.88 67.94,11.43 68.58,10.79 70.48,10.79 71.12,11.43 IC8.6
PWMAB
  Top 0.203: IC5.P$8 42.86,21.59 42.07,20.8 42.07,14.29 43.18,13.18 IC6.6
PWMAC
  Top 0.203: IC3.P$8 22.23,21.59 24.61,19.21 24.61,16.35 26.67,14.29 IC4.6
VCC  (via drill 0.99)
  Top 0.203: IC1.P$6 3.81,24.13 4.6,24.92 4.6,35.88 3.81,36.67 D2.P$1 3.81,36.83 7.62,36.83 | 7.62,36.83 11.43,36.83 | 7.62,36.83 D1.P$1 | 26.67,36.83 25.88,36.83 | 25.88,36.83 22.86,36.83 D15.P$1 22.86,36.2 20,33.34 20,30.96 19.37,30.32 19.37,28.57 20.64,27.3 22.86,27.3 23.02,27.15 23.02,24.92 22.23,24.13 IC3.P$6 19.21,24.13 17.3,26.04 15.24,26.04 14.45,26.83 14.45,35.88 15.24,36.67 D3.P$1 15.24,36.83 11.43,36.83 | 26.67,36.83 30.48,36.83 | 26.67,36.83 D14.P$1 25.88,36.83 | 30.48,36.83 34.29,36.83 D16.P$1 | 30.48,36.83 D13.P$1 | 11.43,36.83 D4.P$1 | 68.58,36.83 64.77,36.83 D31.P$1 64.77,35.56 62.87,33.66 62.87,31.75 65.09,29.53 65.09,27.94 64.93,27.78 64.93,23.02 64.14,22.23 IC7.P$6 62.55,22.23 61.12,20.8 61.12,13.18 JP1.4 | 68.58,36.83 72.39,36.83 | 68.58,36.83 D30.P$1 | 72.39,36.83 76.2,36.83 D32.P$1 | 72.39,36.83 D29.P$1 | 48.26,36.83 45.24,36.83 | 45.24,36.83 44.45,36.83 D23.P$1 45.24,36.83 | 48.26,36.83 52.07,36.83 | 48.26,36.83 D22.P$1 | 52.07,36.83 55.88,36.83 D24.P$1 | 52.07,36.83 D21.P$1 | v46.99,18.1 46.67,18.41 46.67,21.27 43.81,24.13 IC5.P$6 42.55,24.13 39.69,26.99 v39.69,28.42 | v45.24,33.97 45.24,36.83 | v25.88,33.97 25.88,36.83
  Bottom 0.203: v46.99,18.1 48.1,16.99 63.82,16.99 64.93,15.88 64.93,12.7 JP1.4 | v45.24,33.97 v39.69,28.42 35.08,33.02 26.83,33.02 v25.88,33.97